# Altium schematic sheet FPGA_CYCLONE.SchDoc: Cyclone EP1C12 FPGA
size A2; Engineer: JR; Organization: Altium Limited; Address1: L3, 12a Rodborough Rd; Address2: Frenchs Forest; Address3: NSW; Address4: Australia 2086; DocumentNumber: 8; SheetNumber: 8; SheetTotal: 10
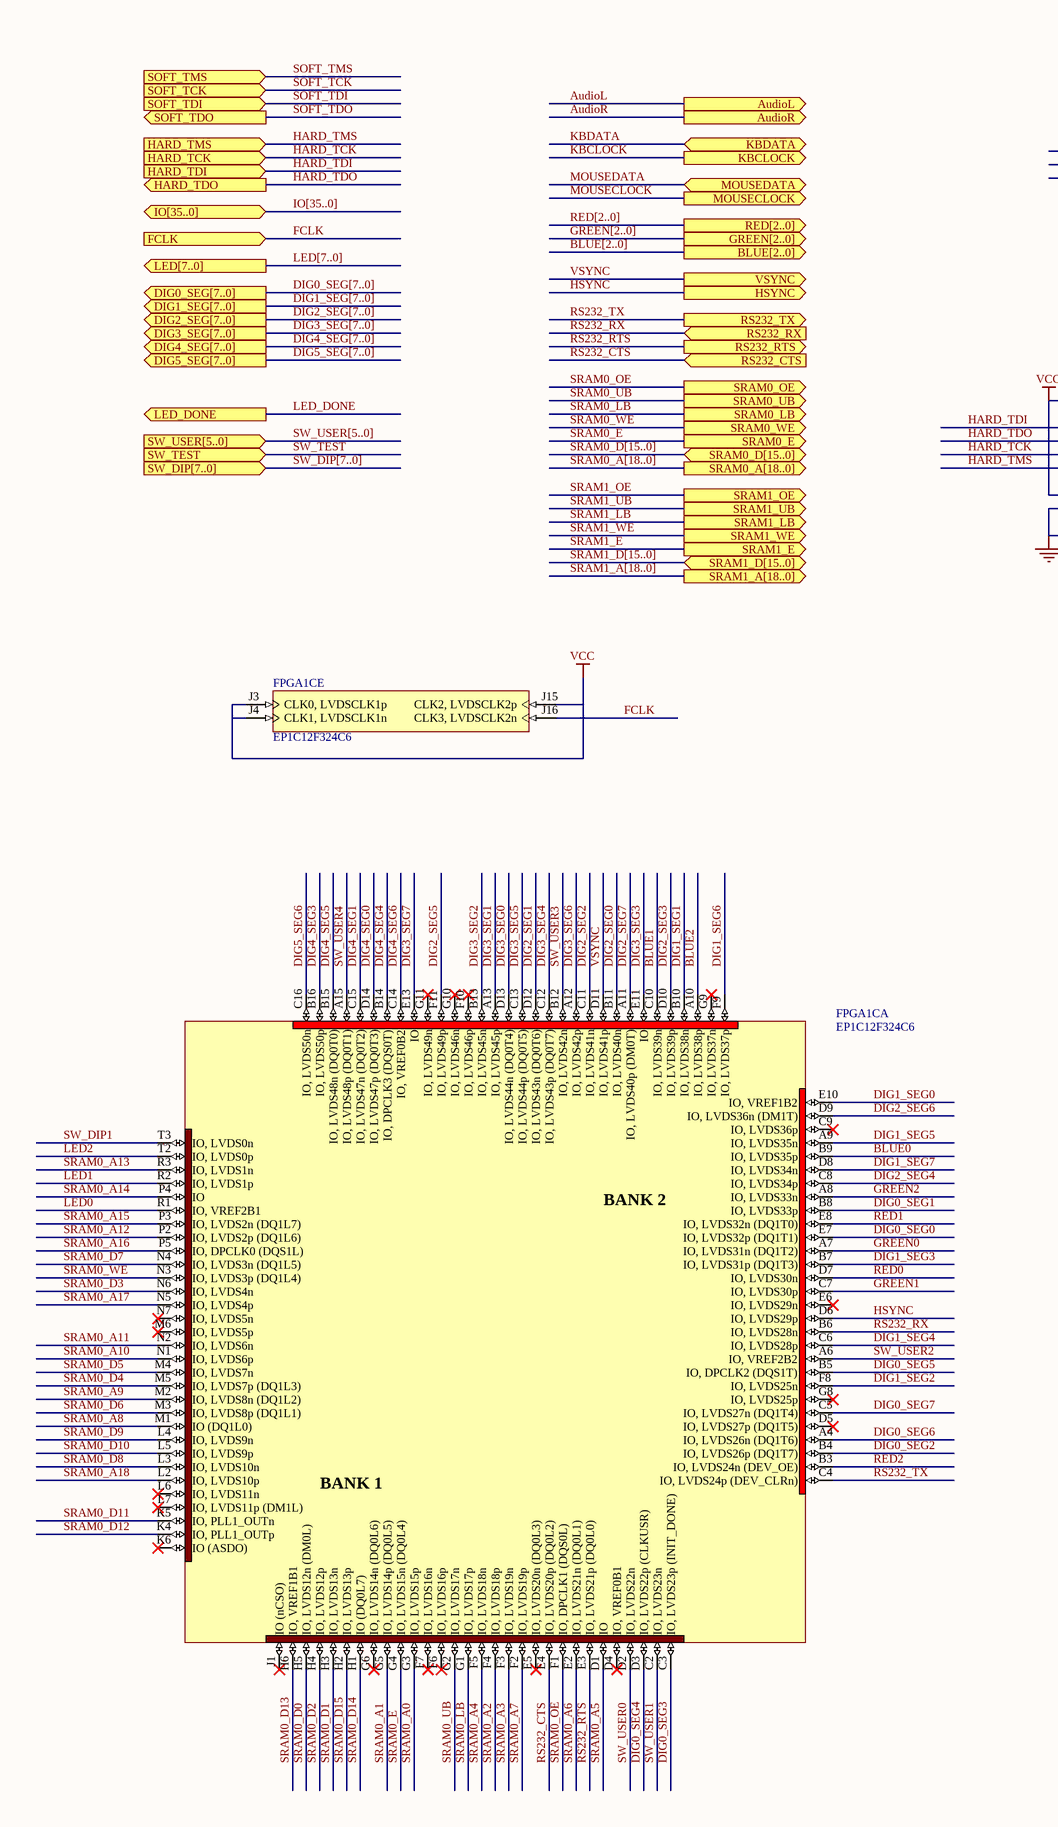
[diagram p0: FPGA_CYCLONE.SchDoc, left]
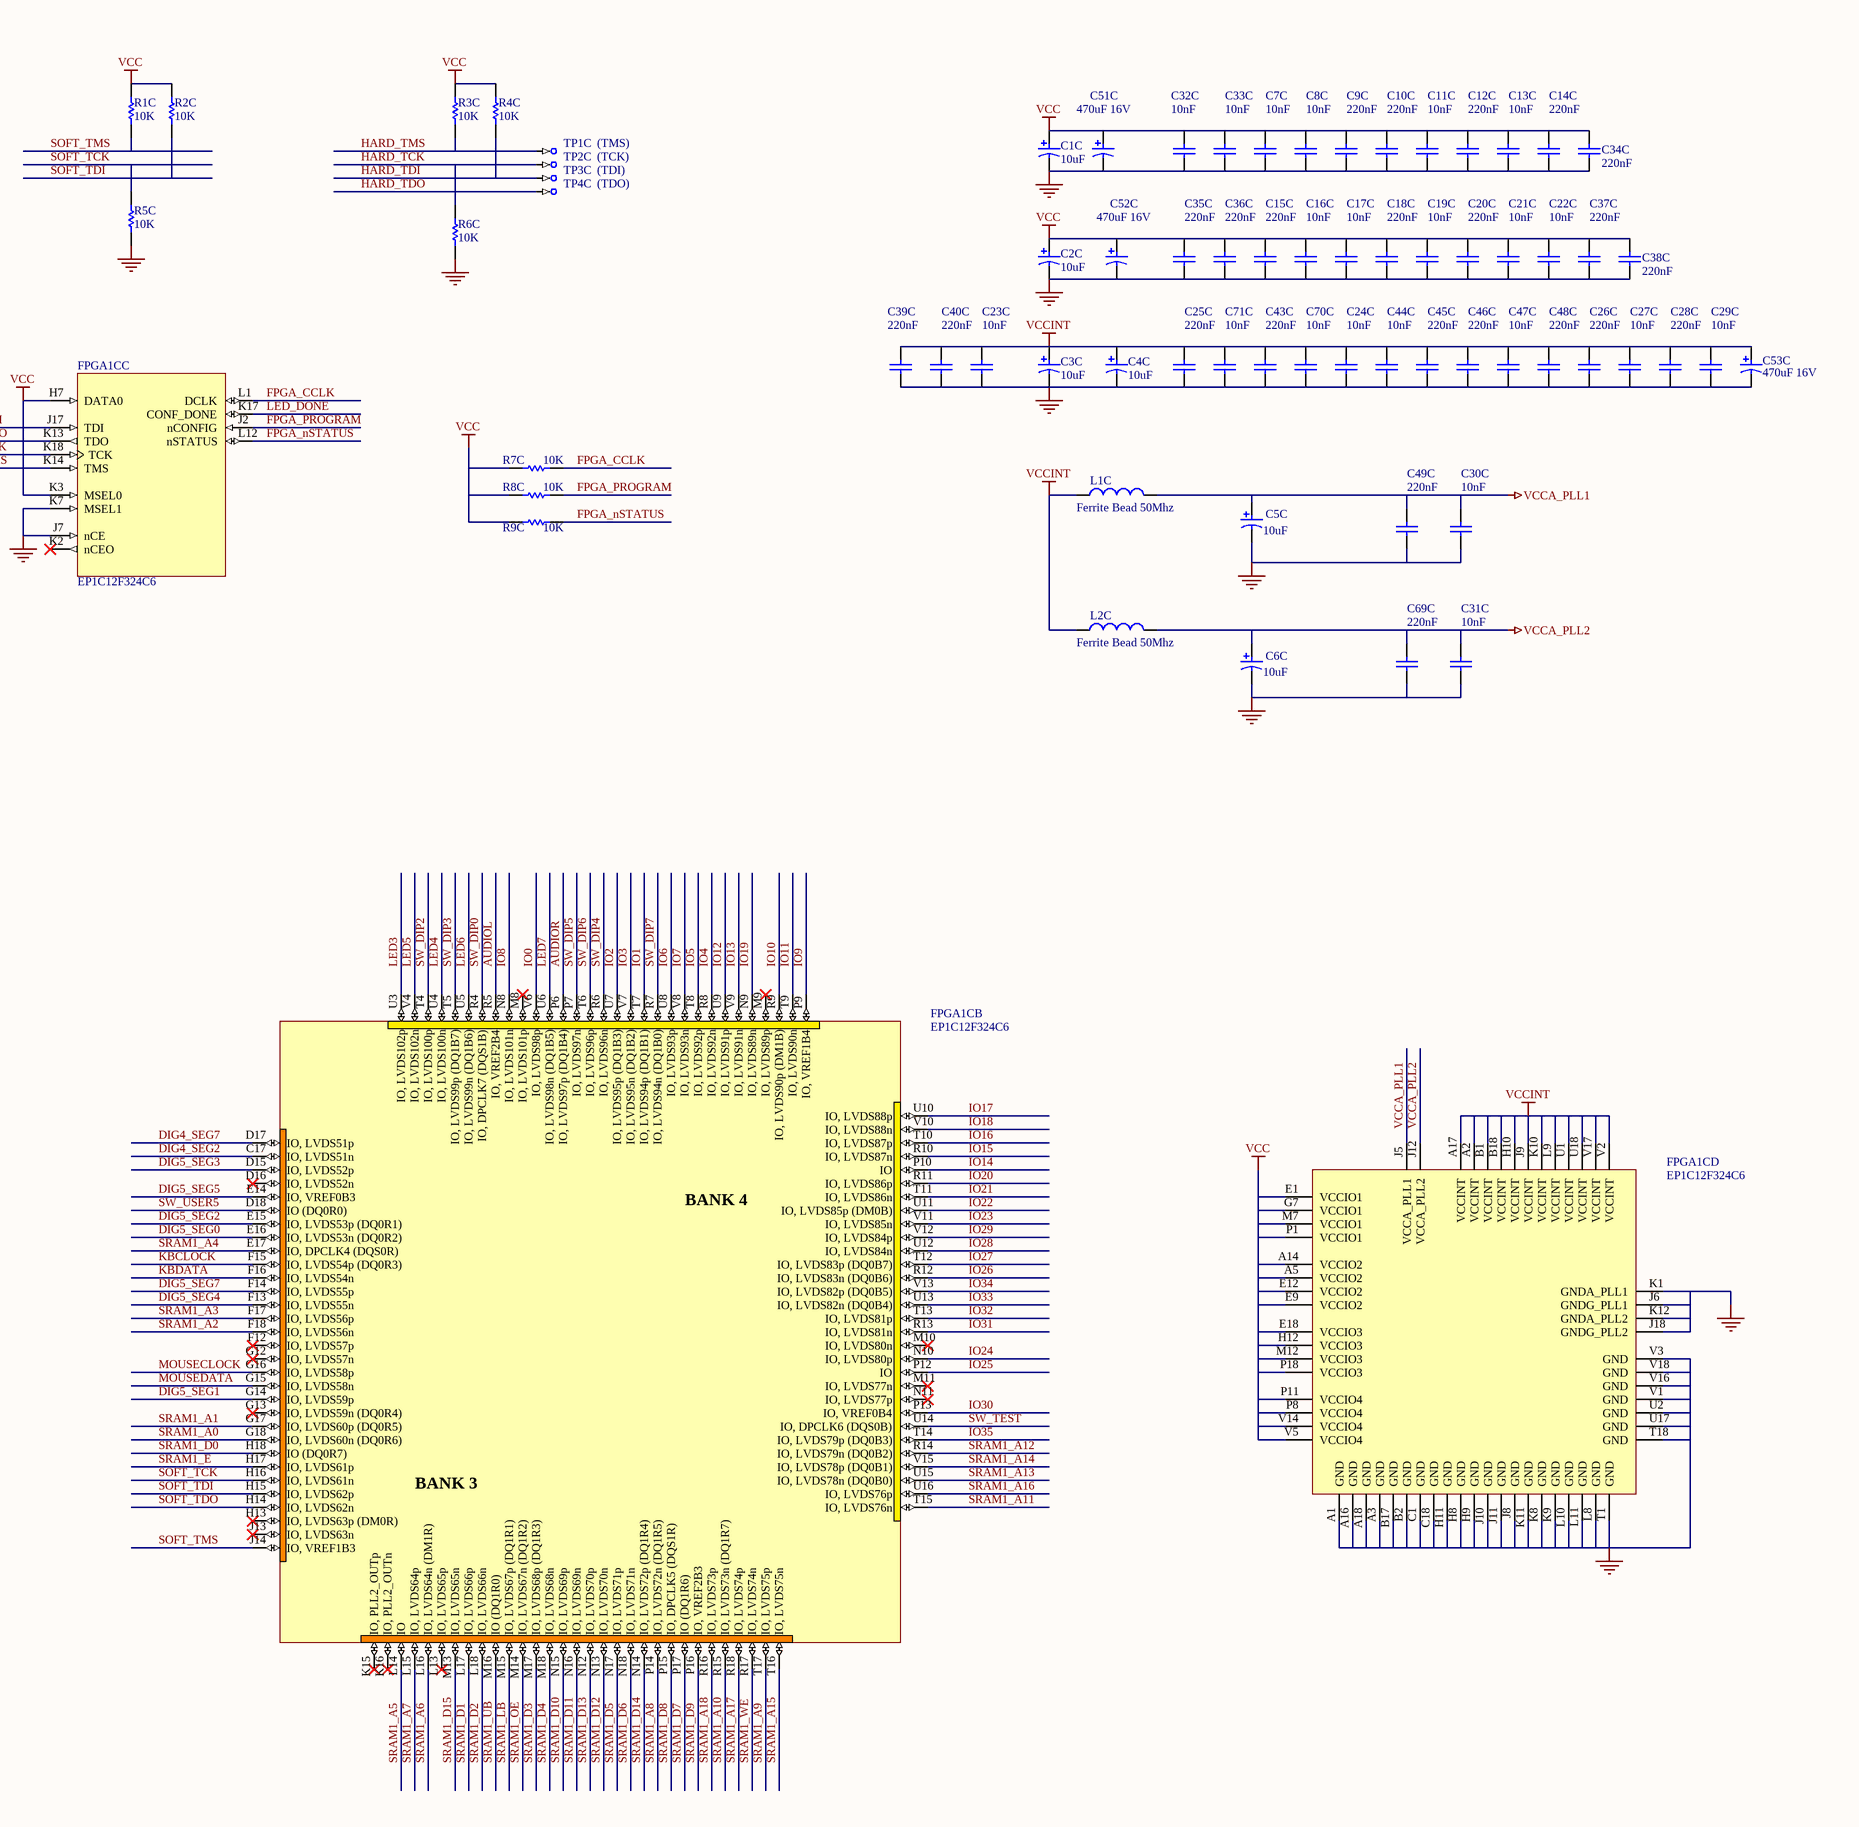
[diagram p1: FPGA_CYCLONE.SchDoc, right]

## Parts
C1C  10uF  [MCCT-B]
C2C  10uF  [MCCT-B]
C3C  10uF  [MCCT-B]
C4C  10uF  [MCCT-B]
C5C  10uF  [MCCT-B]
C6C  10uF  [MCCT-B]
C7C  10nF  [CC1608-0603]
C8C  10nF  [CC1608-0603]
C9C  220nF  [CC1608-0603]
C10C  220nF  [CC1608-0603]
C11C  10nF  [CC1608-0603]
C12C  220nF  [CC1608-0603]
C13C  10nF  [CC1608-0603]
C14C  220nF  [CC1608-0603]
C15C  220nF  [CC1608-0603]
C16C  10nF  [CC1608-0603]
C17C  10nF  [CC1608-0603]
C18C  220nF  [CC1608-0603]
C19C  10nF  [CC1608-0603]
C20C  220nF  [CC1608-0603]
C21C  10nF  [CC1608-0603]
C22C  10nF  [CC1608-0603]
C23C  10nF  [CC1608-0603]
C24C  10nF  [CC1608-0603]
C25C  220nF  [CC1608-0603]
C26C  220nF  [CC1608-0603]
C27C  10nF  [CC1608-0603]
C28C  220nF  [CC1608-0603]
C29C  10nF  [CC1608-0603]
C30C  10nF  [CC1608-0603]
C31C  10nF  [CC1608-0603]
C32C  10nF  [CC1608-0603]
C33C  10nF  [CC1608-0603]
C34C  220nF  [CC1608-0603]
C35C  220nF  [CC1608-0603]
C36C  220nF  [CC1608-0603]
C37C  220nF  [CC1608-0603]
C38C  220nF  [CC1608-0603]
C39C  220nF  [CC1608-0603]
C40C  220nF  [CC1608-0603]
C43C  220nF  [CC1608-0603]
C44C  10nF  [CC1608-0603]
C45C  220nF  [CC1608-0603]
C46C  220nF  [CC1608-0603]
C47C  10nF  [CC1608-0603]
C48C  220nF  [CC1608-0603]
C49C  220nF  [CC1608-0603]
C51C  470uF 16V  [RB8/3.5]
C52C  470uF 16V  [RB8/3.5]
C53C  470uF 16V  [RB8/3.5]
C69C  220nF  [CC1608-0603]
C70C  10nF  [CC1608-0603]
C71C  10nF  [CC1608-0603]
FPGA1C  EP1C12F324C6  [FBGA324]  (parts A,B,C,D,E of 5)
L1C  Ferrite Bead 50Mhz  [CC2012-0805]
L2C  Ferrite Bead 50Mhz  [CC2012-0805]
R1C  10K  [CC2012-0805]
R2C  10K  [CC2012-0805]
R3C  10K  [CC2012-0805]
R4C  10K  [CC2012-0805]
R5C  10K  [CC2012-0805]
R6C  10K  [CC2012-0805]
R7C  10K  [CC2012-0805]
R8C  10K  [CC2012-0805]
R9C  10K  [CC2012-0805]
TP1C  (TMS)  [TestPin]  (no BOM)
TP2C  (TCK)  [TestPin]  (no BOM)
TP3C  (TDI)  [TestPin]  (no BOM)
TP4C  (TDO)  [TestPin]  (no BOM)

## Ports
AudioL (out), AudioR (out), BLUE[2..0] (out), DIG0_SEG[7..0] (out), DIG1_SEG[7..0] (out), DIG2_SEG[7..0] (out), DIG3_SEG[7..0] (out), DIG4_SEG[7..0] (out), DIG5_SEG[7..0] (out), FCLK (in), GREEN[2..0] (out), HARD_TCK (in), HARD_TDI (in), HARD_TDO (out), HARD_TMS (in), HSYNC (out), IO[35..0] (bidir), KBCLOCK (out), KBDATA (bidir), LED[7..0] (out), LED_DONE (out), MOUSECLOCK (out), MOUSEDATA (bidir), RED[2..0] (out), RS232_CTS (in), RS232_RTS (out), RS232_RX (in), RS232_TX (out), SOFT_TCK (in), SOFT_TDI (in), SOFT_TDO (out), SOFT_TMS (in), SRAM0_A[18..0] (out), SRAM0_D[15..0] (bidir), SRAM0_E (out), SRAM0_LB (out), SRAM0_OE (out), SRAM0_UB (out), SRAM0_WE (out), SRAM1_A[18..0] (out), SRAM1_D[15..0] (bidir), SRAM1_E (out), SRAM1_LB (out), SRAM1_OE (out), SRAM1_UB (out), SRAM1_WE (out), SW_DIP[7..0] (in), SW_TEST (in), SW_USER[5..0] (in), VSYNC (out)

## Nets
GND: C1C.2 C2C.2 C3C.2 C4C.2 C5C.2 C6C.2 C7C.2 C8C.2 C9C.2 C10C.2 C11C.2 C12C.2 C13C.2 C14C.2 C15C.2 C16C.2 C17C.2 C18C.2 C19C.2 C20C.2 C21C.2 C22C.2 C23C.2 C24C.2 C25C.2 C26C.2 C27C.2 C28C.2 C29C.2 C30C.2 C31C.2 C32C.2 C33C.2 C34C.2 C35C.2 C36C.2 C37C.2 C38C.2 C39C.2 C40C.2 C43C.2 C44C.2 C45C.2 C46C.2 C47C.2 C48C.2 C49C.2 C51C.2 C52C.2 C53C.2 C69C.2 C70C.2 C71C.2 FPGA1C.A1(GND) FPGA1C.A3(GND) FPGA1C.A16(GND) FPGA1C.A18(GND) FPGA1C.B2(GND) FPGA1C.B17(GND) FPGA1C.C1(GND) FPGA1C.C18(GND) FPGA1C.H8(GND) FPGA1C.H9(GND) FPGA1C.H11(GND) FPGA1C.J6(GNDG_PLL1) FPGA1C.J7(nCE) FPGA1C.J8(GND) FPGA1C.J10(GND) FPGA1C.J11(GND) FPGA1C.J18(GNDG_PLL2) FPGA1C.K1(GNDA_PLL1) FPGA1C.K7(MSEL1) FPGA1C.K8(GND) FPGA1C.K9(GND) FPGA1C.K11(GND) FPGA1C.K12(GNDA_PLL2) FPGA1C.L8(GND) FPGA1C.L10(GND) FPGA1C.L11(GND) FPGA1C.T1(GND) FPGA1C.T18(GND) FPGA1C.U2(GND) FPGA1C.U17(GND) FPGA1C.V1(GND) FPGA1C.V3(GND) FPGA1C.V16(GND) FPGA1C.V18(GND) R5C.2 R6C.2
VCC: C1C.1 C2C.1 C7C.1 C8C.1 C9C.1 C10C.1 C11C.1 C12C.1 C13C.1 C14C.1 C15C.1 C16C.1 C17C.1 C18C.1 C19C.1 C20C.1 C21C.1 C22C.1 C32C.1 C33C.1 C34C.1 C35C.1 C36C.1 C37C.1 C38C.1 C51C.1 C52C.1 FPGA1C.A5(VCCIO2) FPGA1C.A14(VCCIO2) FPGA1C.E1(VCCIO1) FPGA1C.E9(VCCIO2) FPGA1C.E12(VCCIO2) FPGA1C.E18(VCCIO3) FPGA1C.G7(VCCIO1) FPGA1C.H7(DATA0) FPGA1C.H12(VCCIO3) FPGA1C.J3(CLK0,_LVDSCLK1p) FPGA1C.J4(CLK1,_LVDSCLK1n) FPGA1C.J15(CLK2,_LVDSCLK2p) FPGA1C.K3(MSEL0) FPGA1C.M7(VCCIO1) FPGA1C.M12(VCCIO3) FPGA1C.P1(VCCIO1) FPGA1C.P8(VCCIO4) FPGA1C.P11(VCCIO4) FPGA1C.P18(VCCIO3) FPGA1C.V5(VCCIO4) FPGA1C.V14(VCCIO4) R1C.1 R2C.1 R3C.1 R4C.1 R7C.1 R8C.1 R9C.1
VCCA_PLL1: C5C.1 C30C.1 C49C.1 FPGA1C.J5(VCCA_PLL1) L1C.2
VCCA_PLL2: C6C.1 C31C.1 C69C.1 FPGA1C.J12(VCCA_PLL2) L2C.2
VCCINT: C3C.1 C4C.1 C23C.1 C24C.1 C25C.1 C26C.1 C27C.1 C28C.1 C29C.1 C39C.1 C40C.1 C43C.1 C44C.1 C45C.1 C46C.1 C47C.1 C48C.1 C53C.1 C70C.1 C71C.1 FPGA1C.A2(VCCINT) FPGA1C.A17(VCCINT) FPGA1C.B1(VCCINT) FPGA1C.B18(VCCINT) FPGA1C.H10(VCCINT) FPGA1C.J9(VCCINT) FPGA1C.K10(VCCINT) FPGA1C.L9(VCCINT) FPGA1C.U1(VCCINT) FPGA1C.U18(VCCINT) FPGA1C.V2(VCCINT) FPGA1C.V17(VCCINT) L1C.1 L2C.1
AudioL: FPGA1C.R5(IO,_VREF2B4) ; port AudioL
AudioR: FPGA1C.P6(IO,_LVDS97p_(DQ1B4)) ; port AudioR
BLUE0: FPGA1C.B9(IO,_LVDS35p)
BLUE1: FPGA1C.C10(IO,_LVDS39n)
BLUE2: FPGA1C.A10(IO,_LVDS38p)
DIG0_SEG0: FPGA1C.E7(IO,_LVDS32p_(DQ1T1))
DIG0_SEG1: FPGA1C.B8(IO,_LVDS33p)
DIG0_SEG2: FPGA1C.B4(IO,_LVDS26p_(DQ1T7))
DIG0_SEG3: FPGA1C.C3(IO,_LVDS23p_(INIT_DONE))
DIG0_SEG4: FPGA1C.D3(IO,_LVDS22p_(CLKUSR))
DIG0_SEG5: FPGA1C.B5(IO,_DPCLK2_(DQS1T))
DIG0_SEG6: FPGA1C.A4(IO,_LVDS26n_(DQ1T6))
DIG0_SEG7: FPGA1C.C5(IO,_LVDS27n_(DQ1T4))
DIG1_SEG0: FPGA1C.E10(IO,_VREF1B2)
DIG1_SEG1: FPGA1C.B10(IO,_LVDS38n)
DIG1_SEG2: FPGA1C.F8(IO,_LVDS25n)
DIG1_SEG3: FPGA1C.B7(IO,_LVDS31p_(DQ1T3))
DIG1_SEG4: FPGA1C.C6(IO,_LVDS28p)
DIG1_SEG5: FPGA1C.A9(IO,_LVDS35n)
DIG1_SEG6: FPGA1C.F9(IO,_LVDS37p)
DIG1_SEG7: FPGA1C.D8(IO,_LVDS34n)
DIG2_SEG0: FPGA1C.B11(IO,_LVDS40n)
DIG2_SEG1: FPGA1C.D12(IO,_LVDS43n_(DQ0T6))
DIG2_SEG2: FPGA1C.C11(IO,_LVDS41n)
DIG2_SEG3: FPGA1C.D10(IO,_LVDS39p)
DIG2_SEG4: FPGA1C.C8(IO,_LVDS34p)
DIG2_SEG5: FPGA1C.F11(IO,_LVDS49p)
DIG2_SEG6: FPGA1C.D9(IO,_LVDS36n_(DM1T))
DIG2_SEG7: FPGA1C.A11(IO,_LVDS40p_(DM0T))
DIG3_SEG0: FPGA1C.D13(IO,_LVDS44n_(DQ0T4))
DIG3_SEG1: FPGA1C.A13(IO,_LVDS45p)
DIG3_SEG2: FPGA1C.B13(IO,_LVDS45n)
DIG3_SEG3: FPGA1C.E11(IO)
DIG3_SEG4: FPGA1C.C12(IO,_LVDS43p_(DQ0T7))
DIG3_SEG5: FPGA1C.C13(IO,_LVDS44p_(DQ0T5))
DIG3_SEG6: FPGA1C.A12(IO,_LVDS42p)
DIG3_SEG7: FPGA1C.E13(IO)
DIG4_SEG0: FPGA1C.D14(IO,_LVDS47p_(DQ0T3))
DIG4_SEG1: FPGA1C.C15(IO,_LVDS47n_(DQ0T2))
DIG4_SEG2: FPGA1C.C17(IO,_LVDS51n)
DIG4_SEG3: FPGA1C.B16(IO,_LVDS50p)
DIG4_SEG4: FPGA1C.B14(IO,_DPCLK3_(DQS0T))
DIG4_SEG5: FPGA1C.B15(IO,_LVDS48n_(DQ0T0))
DIG4_SEG6: FPGA1C.C14(IO,_VREF0B2)
DIG4_SEG7: FPGA1C.D17(IO,_LVDS51p)
DIG5_SEG0: FPGA1C.E16(IO,_LVDS53n_(DQ0R2))
DIG5_SEG1: FPGA1C.G14(IO,_LVDS59p)
DIG5_SEG2: FPGA1C.E15(IO,_LVDS53p_(DQ0R1))
DIG5_SEG3: FPGA1C.D15(IO,_LVDS52p)
DIG5_SEG4: FPGA1C.F13(IO,_LVDS55n)
DIG5_SEG5: FPGA1C.E14(IO,_VREF0B3)
DIG5_SEG6: FPGA1C.C16(IO,_LVDS50n)
DIG5_SEG7: FPGA1C.F14(IO,_LVDS55p)
FCLK: FPGA1C.J16(CLK3,_LVDSCLK2n) ; port FCLK
FPGA_CCLK: FPGA1C.L1(DCLK) R7C.2
FPGA_nSTATUS: FPGA1C.L12(nSTATUS) R9C.2
FPGA_PROGRAM: FPGA1C.J2(nCONFIG) R8C.2
GREEN0: FPGA1C.A7(IO,_LVDS31n_(DQ1T2))
GREEN1: FPGA1C.C7(IO,_LVDS30p)
GREEN2: FPGA1C.A8(IO,_LVDS33n)
HARD_TCK: FPGA1C.K18(TCK) R6C.1 TP2C.1 ; port HARD_TCK
HARD_TDI: FPGA1C.J17(TDI) R4C.2 TP3C.1 ; port HARD_TDI
HARD_TDO: FPGA1C.K13(TDO) TP4C.1 ; port HARD_TDO
HARD_TMS: FPGA1C.K14(TMS) R3C.2 TP1C.1 ; port HARD_TMS
HSYNC: FPGA1C.D6(IO,_LVDS29p) ; port HSYNC
IO0: FPGA1C.V6(IO,_LVDS98p)
IO1: FPGA1C.T7(IO,_LVDS94p_(DQ1B1))
IO2: FPGA1C.U7(IO,_LVDS95p_(DQ1B3))
IO3: FPGA1C.V7(IO,_LVDS95n_(DQ1B2))
IO4: FPGA1C.R8(IO,_LVDS92n)
IO5: FPGA1C.T8(IO,_LVDS92p)
IO6: FPGA1C.U8(IO,_LVDS93p)
IO7: FPGA1C.V8(IO,_LVDS93n)
IO8: FPGA1C.N8(IO,_LVDS101n)
IO9: FPGA1C.P9(IO,_VREF1B4)
IO10: FPGA1C.R9(IO,_LVDS90p_(DM1B))
IO11: FPGA1C.T9(IO,_LVDS90n)
IO12: FPGA1C.U9(IO,_LVDS91p)
IO13: FPGA1C.V9(IO,_LVDS91n)
IO14: FPGA1C.P10(IO)
IO15: FPGA1C.R10(IO,_LVDS87n)
IO16: FPGA1C.T10(IO,_LVDS87p)
IO17: FPGA1C.U10(IO,_LVDS88p)
IO18: FPGA1C.V10(IO,_LVDS88n)
IO19: FPGA1C.N9(IO,_LVDS89n)
IO20: FPGA1C.R11(IO,_LVDS86p)
IO21: FPGA1C.T11(IO,_LVDS86n)
IO22: FPGA1C.U11(IO,_LVDS85p_(DM0B))
IO23: FPGA1C.V11(IO,_LVDS85n)
IO24: FPGA1C.N10(IO,_LVDS80p)
IO25: FPGA1C.P12(IO)
IO26: FPGA1C.R12(IO,_LVDS83n_(DQ0B6))
IO27: FPGA1C.T12(IO,_LVDS83p_(DQ0B7))
IO28: FPGA1C.U12(IO,_LVDS84n)
IO29: FPGA1C.V12(IO,_LVDS84p)
IO30: FPGA1C.P13(IO,_VREF0B4)
IO31: FPGA1C.R13(IO,_LVDS81n)
IO32: FPGA1C.T13(IO,_LVDS81p)
IO33: FPGA1C.U13(IO,_LVDS82n_(DQ0B4))
IO34: FPGA1C.V13(IO,_LVDS82p_(DQ0B5))
IO35: FPGA1C.T14(IO,_LVDS79p_(DQ0B3))
KBCLOCK: FPGA1C.F15(IO,_LVDS54p_(DQ0R3)) ; port KBCLOCK
KBDATA: FPGA1C.F16(IO,_LVDS54n) ; port KBDATA
LED0: FPGA1C.R1(IO,_VREF2B1)
LED1: FPGA1C.R2(IO,_LVDS1p)
LED2: FPGA1C.T2(IO,_LVDS0p)
LED3: FPGA1C.U3(IO,_LVDS102p)
LED4: FPGA1C.U4(IO,_LVDS100n)
LED5: FPGA1C.V4(IO,_LVDS102n)
LED6: FPGA1C.U5(IO,_LVDS99n_(DQ1B6))
LED7: FPGA1C.U6(IO,_LVDS98n_(DQ1B5))
LED_DONE: FPGA1C.K17(CONF_DONE) ; port LED_DONE
MOUSECLOCK: FPGA1C.G16(IO,_LVDS58p) ; port MOUSECLOCK
MOUSEDATA: FPGA1C.G15(IO,_LVDS58n) ; port MOUSEDATA
RED0: FPGA1C.D7(IO,_LVDS30n)
RED1: FPGA1C.E8(IO,_LVDS32n_(DQ1T0))
RED2: FPGA1C.B3(IO,_LVDS24n_(DEV_OE))
RS232_CTS: FPGA1C.E4(IO,_LVDS20p_(DQ0L2)) ; port RS232_CTS
RS232_RTS: FPGA1C.E3(IO,_LVDS21p_(DQ0L0)) ; port RS232_RTS
RS232_RX: FPGA1C.B6(IO,_LVDS28n) ; port RS232_RX
RS232_TX: FPGA1C.C4(IO,_LVDS24p_(DEV_CLRn)) ; port RS232_TX
SOFT_TCK: FPGA1C.H16(IO,_LVDS61n) R5C.1 ; port SOFT_TCK
SOFT_TDI: FPGA1C.H15(IO,_LVDS62p) R2C.2 ; port SOFT_TDI
SOFT_TDO: FPGA1C.H14(IO,_LVDS62n) ; port SOFT_TDO
SOFT_TMS: FPGA1C.J14(IO,_VREF1B3) R1C.2 ; port SOFT_TMS
SRAM0_A0: FPGA1C.G3(IO,_LVDS15p)
SRAM0_A1: FPGA1C.G5(IO,_LVDS14p_(DQ0L5))
SRAM0_A2: FPGA1C.F4(IO,_LVDS18p)
SRAM0_A3: FPGA1C.F3(IO,_LVDS19n)
SRAM0_A4: FPGA1C.F5(IO,_LVDS18n)
SRAM0_A5: FPGA1C.D1(IO)
SRAM0_A6: FPGA1C.E2(IO,_LVDS21n_(DQ0L1))
SRAM0_A7: FPGA1C.F2(IO,_LVDS19p)
SRAM0_A8: FPGA1C.M1(IO_(DQ1L0))
SRAM0_A9: FPGA1C.M2(IO,_LVDS8n_(DQ1L2))
SRAM0_A10: FPGA1C.N1(IO,_LVDS6p)
SRAM0_A11: FPGA1C.N2(IO,_LVDS6n)
SRAM0_A12: FPGA1C.P2(IO,_LVDS2p_(DQ1L6))
SRAM0_A13: FPGA1C.R3(IO,_LVDS1n)
SRAM0_A14: FPGA1C.P4(IO)
SRAM0_A15: FPGA1C.P3(IO,_LVDS2n_(DQ1L7))
SRAM0_A16: FPGA1C.P5(IO,_DPCLK0_(DQS1L))
SRAM0_A17: FPGA1C.N5(IO,_LVDS4p)
SRAM0_A18: FPGA1C.L2(IO,_LVDS10p)
SRAM0_D0: FPGA1C.H5(IO,_LVDS12n_(DM0L))
SRAM0_D1: FPGA1C.H3(IO,_LVDS13n)
SRAM0_D2: FPGA1C.H4(IO,_LVDS12p)
SRAM0_D3: FPGA1C.N6(IO,_LVDS4n)
SRAM0_D4: FPGA1C.M5(IO,_LVDS7p_(DQ1L3))
SRAM0_D5: FPGA1C.M4(IO,_LVDS7n)
SRAM0_D6: FPGA1C.M3(IO,_LVDS8p_(DQ1L1))
SRAM0_D7: FPGA1C.N4(IO,_LVDS3n_(DQ1L5))
SRAM0_D8: FPGA1C.L3(IO,_LVDS10n)
SRAM0_D9: FPGA1C.L4(IO,_LVDS9n)
SRAM0_D10: FPGA1C.L5(IO,_LVDS9p)
SRAM0_D11: FPGA1C.K5(IO,_PLL1_OUTn)
SRAM0_D12: FPGA1C.K4(IO,_PLL1_OUTp)
SRAM0_D13: FPGA1C.H6(IO,_VREF1B1)
SRAM0_D14: FPGA1C.H1(IO_(DQ0L7))
SRAM0_D15: FPGA1C.H2(IO,_LVDS13p)
SRAM0_E: FPGA1C.G4(IO,_LVDS15n_(DQ0L4)) ; port SRAM0_E
SRAM0_LB: FPGA1C.G1(IO,_LVDS17p) ; port SRAM0_LB
SRAM0_OE: FPGA1C.F1(IO,_DPCLK1_(DQS0L)) ; port SRAM0_OE
SRAM0_UB: FPGA1C.G2(IO,_LVDS17n) ; port SRAM0_UB
SRAM0_WE: FPGA1C.N3(IO,_LVDS3p_(DQ1L4)) ; port SRAM0_WE
SRAM1_A0: FPGA1C.G18(IO,_LVDS60n_(DQ0R6))
SRAM1_A1: FPGA1C.G17(IO,_LVDS60p_(DQ0R5))
SRAM1_A2: FPGA1C.F18(IO,_LVDS56n)
SRAM1_A3: FPGA1C.F17(IO,_LVDS56p)
SRAM1_A4: FPGA1C.E17(IO,_DPCLK4_(DQS0R))
SRAM1_A5: FPGA1C.L14(IO)
SRAM1_A6: FPGA1C.L16(IO,_LVDS64n_(DM1R))
SRAM1_A7: FPGA1C.L15(IO,_LVDS64p)
SRAM1_A8: FPGA1C.P14(IO,_LVDS72n_(DQ1R5))
SRAM1_A9: FPGA1C.T17(IO,_LVDS75p)
SRAM1_A10: FPGA1C.R15(IO,_LVDS73n_(DQ1R7))
SRAM1_A11: FPGA1C.T15(IO,_LVDS76n)
SRAM1_A12: FPGA1C.R14(IO,_LVDS79n_(DQ0B2))
SRAM1_A13: FPGA1C.U15(IO,_LVDS78n_(DQ0B0))
SRAM1_A14: FPGA1C.V15(IO,_LVDS78p_(DQ0B1))
SRAM1_A15: FPGA1C.T16(IO,_LVDS75n)
SRAM1_A16: FPGA1C.U16(IO,_LVDS76p)
SRAM1_A17: FPGA1C.R18(IO,_LVDS74p)
SRAM1_A18: FPGA1C.R16(IO,_LVDS73p)
SRAM1_D0: FPGA1C.H18(IO_(DQ0R7))
SRAM1_D1: FPGA1C.L17(IO,_LVDS66p)
SRAM1_D2: FPGA1C.L18(IO,_LVDS66n)
SRAM1_D3: FPGA1C.M17(IO,_LVDS68p_(DQ1R3))
SRAM1_D4: FPGA1C.M18(IO,_LVDS68n)
SRAM1_D5: FPGA1C.N17(IO,_LVDS71p)
SRAM1_D6: FPGA1C.N18(IO,_LVDS71n)
SRAM1_D7: FPGA1C.P17(IO_(DQ1R6))
SRAM1_D8: FPGA1C.P15(IO,_DPCLK5_(DQS1R))
SRAM1_D9: FPGA1C.P16(IO,_VREF2B3)
SRAM1_D10: FPGA1C.N15(IO,_LVDS69p)
SRAM1_D11: FPGA1C.N16(IO,_LVDS69n)
SRAM1_D12: FPGA1C.N13(IO,_LVDS70n)
SRAM1_D13: FPGA1C.N12(IO,_LVDS70p)
SRAM1_D14: FPGA1C.N14(IO,_LVDS72p_(DQ1R4))
SRAM1_D15: FPGA1C.M13(IO,_LVDS65n)
SRAM1_E: FPGA1C.H17(IO,_LVDS61p) ; port SRAM1_E
SRAM1_LB: FPGA1C.M15(IO,_LVDS67p_(DQ1R1)) ; port SRAM1_LB
SRAM1_OE: FPGA1C.M14(IO,_LVDS67n_(DQ1R2)) ; port SRAM1_OE
SRAM1_UB: FPGA1C.M16(IO_(DQ1R0)) ; port SRAM1_UB
SRAM1_WE: FPGA1C.R17(IO,_LVDS74n) ; port SRAM1_WE
SW_DIP0: FPGA1C.R4(IO,_DPCLK7_(DQS1B))
SW_DIP1: FPGA1C.T3(IO,_LVDS0n)
SW_DIP2: FPGA1C.T4(IO,_LVDS100p)
SW_DIP3: FPGA1C.T5(IO,_LVDS99p_(DQ1B7))
SW_DIP4: FPGA1C.R6(IO,_LVDS96n)
SW_DIP5: FPGA1C.P7(IO,_LVDS97n)
SW_DIP6: FPGA1C.T6(IO,_LVDS96p)
SW_DIP7: FPGA1C.R7(IO,_LVDS94n_(DQ1B0))
SW_TEST: FPGA1C.U14(IO,_DPCLK6_(DQS0B)) ; port SW_TEST
SW_USER0: FPGA1C.D2(IO,_LVDS22n)
SW_USER1: FPGA1C.C2(IO,_LVDS23n)
SW_USER2: FPGA1C.A6(IO,_VREF2B2)
SW_USER3: FPGA1C.B12(IO,_LVDS42n)
SW_USER4: FPGA1C.A15(IO,_LVDS48p_(DQ0T1))
SW_USER5: FPGA1C.D18(IO_(DQ0R0))
VSYNC: FPGA1C.D11(IO,_LVDS41p) ; port VSYNC

Not connected (* = marked no-connect by the designer): FPGA1C C9(IO,_LVDS36p)* D4(IO,_VREF0B1)* D5(IO,_LVDS27p_(DQ1T5))* D16(IO,_LVDS52n)* E5(IO,_LVDS20n_(DQ0L3))* E6(IO,_LVDS29n)* F6(IO,_LVDS16p)* F7(IO,_LVDS16n)* F10(IO,_LVDS46p)* F12(IO,_LVDS57p)* G6(IO,_LVDS14n_(DQ0L6))* G8(IO,_LVDS25p)* G9(IO,_LVDS37n)* G10(IO,_LVDS46n)* G11(IO,_LVDS49n)* G12(IO,_LVDS57n)* G13(IO,_LVDS59n_(DQ0R4))* H13(IO,_LVDS63p_(DM0R))* J1(IO_(nCSO))* J13(IO,_LVDS63n)* K2(nCEO)* K6(IO_(ASDO))* K15(IO,_PLL2_OUTp)* K16(IO,_PLL2_OUTn)* L6(IO,_LVDS11n)* L7(IO,_LVDS11p_(DM1L))* L13(IO,_LVDS65p)* M6(IO,_LVDS5p)* M8(IO,_LVDS101p)* M9(IO,_LVDS89p)* M10(IO,_LVDS80n)* M11(IO,_LVDS77n)* N7(IO,_LVDS5n)* N11(IO,_LVDS77p)*

## Buses and harness runs
bus BLUE[2..0] = port BLUE[2..0]
bus DIG0_SEG[7..0] = port DIG0_SEG[7..0]
bus DIG1_SEG[7..0] = port DIG1_SEG[7..0]
bus DIG2_SEG[7..0] = port DIG2_SEG[7..0]
bus DIG3_SEG[7..0] = port DIG3_SEG[7..0]
bus DIG4_SEG[7..0] = port DIG4_SEG[7..0]
bus DIG5_SEG[7..0] = port DIG5_SEG[7..0]
bus GREEN[2..0] = port GREEN[2..0]
bus IO[35..0] = port IO[35..0]
bus LED[7..0] = port LED[7..0]
bus RED[2..0] = port RED[2..0]
bus SRAM0_A[18..0] = port SRAM0_A[18..0]
bus SRAM0_D[15..0] = port SRAM0_D[15..0]
bus SRAM1_A[18..0] = port SRAM1_A[18..0]
bus SRAM1_D[15..0] = port SRAM1_D[15..0]
bus SW_DIP[7..0] = port SW_DIP[7..0]
bus SW_USER[5..0] = port SW_USER[5..0]

## Notes on the sheet
- Title
- Size:
- Date:
- File:
- A2
- Number:
- Time:
- Revision:
- Sheet
- of
- (in symbol EP1C12F324C6, part A) BANK 2; BANK 1
- (in symbol EP1C12F324C6, part B) BANK 4; BANK 3

## Library data of the parts
C1C C2C C3C C4C C5C C6C = CAP_POLAR: Polar Capacitor; Supplier: FARNELL; Supplier Code: 967-117
C7C C8C C9C C10C C11C C12C C13C C14C C15C C16C C17C C18C C19C C20C C21C C22C C23C C24C C25C C26C C27C C28C C29C C30C C31C C32C C33C C34C C35C C36C C37C C38C C39C C40C C43C C44C C45C C46C C47C C48C C49C C69C C70C C71C = CAP: Capacitor
  C7C C8C C9C C10C C11C C12C C13C C14C C15C C16C C17C C18C C19C C20C C21C C22C C23C C24C C26C C27C C28C C29C C30C C31C C40C C43C C44C C45C C46C C47C C48C C70C: Supplier: FARNELL; Supplier Code: 772-236
  C25C C33C C35C C36C C49C C69C C71C: Supplier: FARNELL; Supplier Code: 335-2020
C51C C52C C53C = CAP_POLAR: Polar Capacitor; Fitted: True
FPGA1C = EP1C12F324C6: Cyclone Family, 1.5V FPGA, 249 I/O Pins, 2 x PLLs, Commercial Grade, Speed Grade 6; Package Information: Latest Revision: ver11.0, Feb-2003; Code - JEDEC: MS-034-AAG-1; Code - IPC: PBGA 19X19 FE324; Published: 17-Sep-2003; Datasheet: Latest Revision: ver1.4, Jan-2004; Package Reference: FBGA324; Publisher: Altium Limited
L1C L2C = Inductor: Farnell part 323-7989; Value: 10mH; Published: 8-Jun-2000; Revision: July-2002: Re-released for DXP Platform.; Publisher: Altium Limited
R1C R2C R3C R4C R5C R6C R7C R8C R9C = RES: Resistor
TP1C TP2C TP3C TP4C = TestPin